# Altium schematic sheet 4th_4G - V4.1.SchDoc
size A3
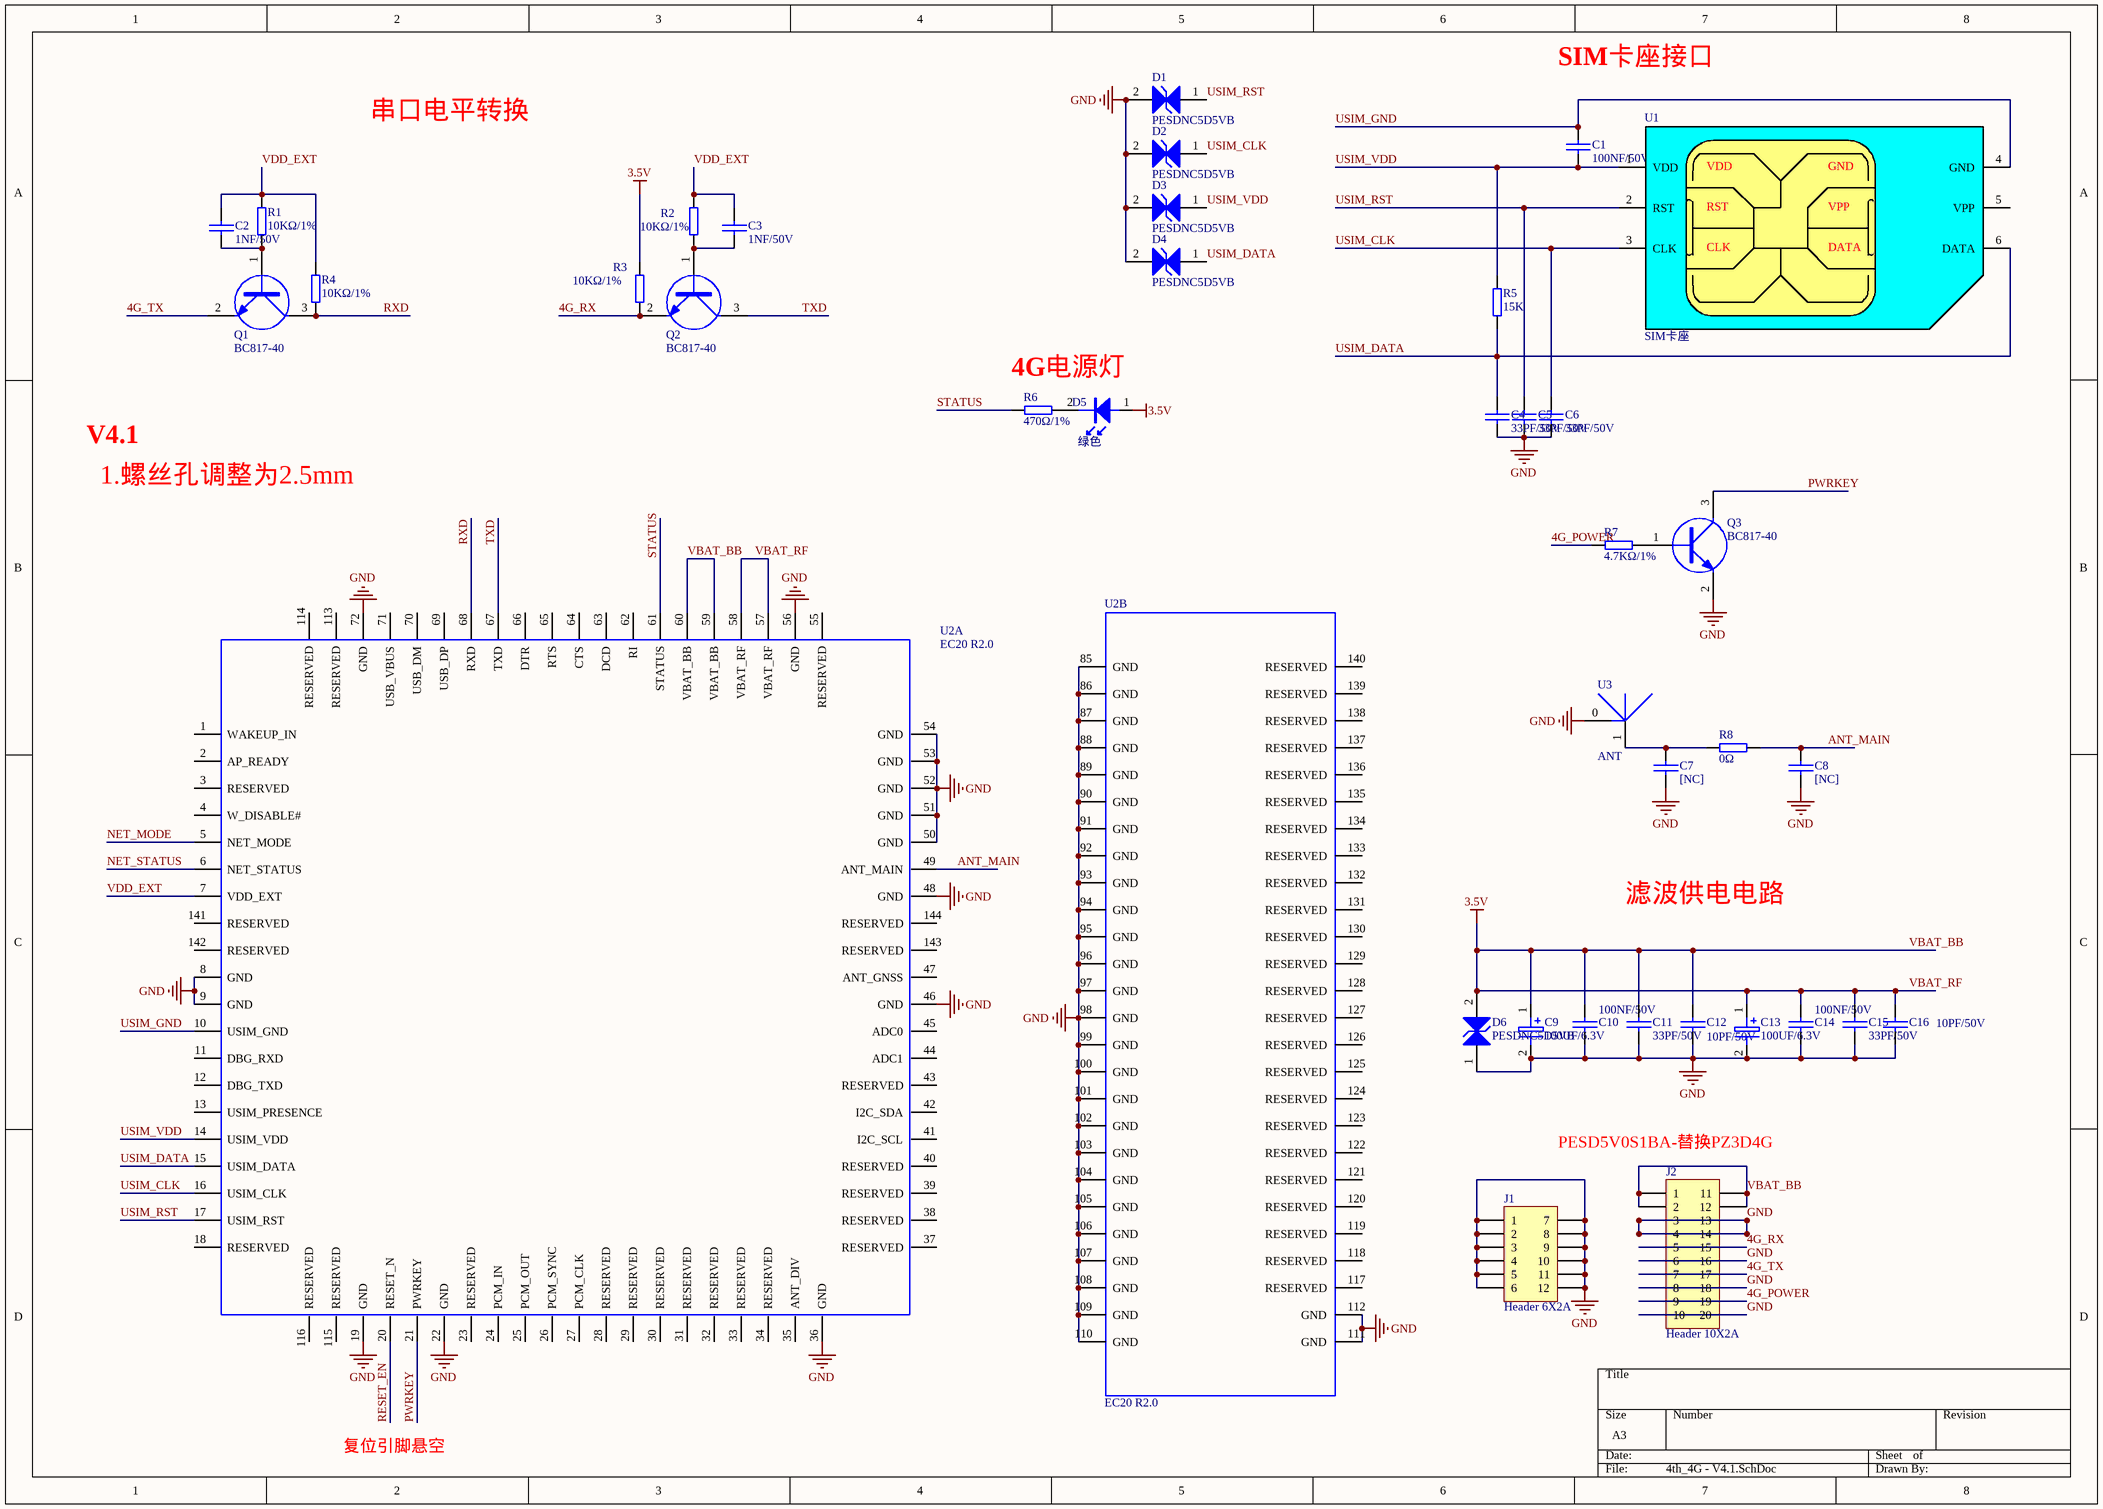
[diagram p0: 4th_4G - V4.1.SchDoc]

## Parts
C1  100NF/50V  [0603_C]
C2  1NF/50V  [0603_C]
C3  1NF/50V  [0603_C]
C4  33PF/50V  [0603_C]
C5  33PF/50V  [0603_C]
C6  33PF/50V  [0603_C]
C7  [NC]  [0603_C]
C8  [NC]  [0603_C]
C9  100UF/6.3V  [CASE-B_3528]
C10  100NF/50V  [0603_C]
C11  33PF/50V  [0603_C]
C12  10PF/50V  [0603_C]
C13  100UF/6.3V  [CASE-B_3528]
C14  100NF/50V  [0603_C]
C15  33PF/50V  [0603_C]
C16  10PF/50V  [0603_C]
D1  PESDNC5D5VB  [SOD-523]
D2  PESDNC5D5VB  [SOD-523]
D3  PESDNC5D5VB  [SOD-523]
D4  PESDNC5D5VB  [SOD-523]
D5  绿色  [0603_D]
D6  PESDNC5D5VB  [SOD-523]
J1  Header 6X2A  [HDR2X6_CEN]
J2  Header 10X2A  [HDR2X10_CEN]
Q1  BC817-40  [SOT-23-3]
Q2  BC817-40  [SOT-23-3]
Q3  BC817-40  [SOT-23-3]
R1  10KΩ/1%  [0603_R]
R2  10KΩ/1%  [0603_R]
R3  10KΩ/1%  [0603_R]
R4  10KΩ/1%  [0603_R]
R5  15K  [0603_R]
R6  470Ω/1%  [0603_R]
R7  4.7KΩ/1%  [0603_R]
R8  0Ω  [0603_R]
U1  SIM卡座  [SIM卡座-NANO掀盖式]
U2  EC20 R2.0  [EC20_R2.0]  (parts A,B of 2)
U3  ANT  [SMA-KWE/弯头]

## Nets
GND: C4.2 C5.2 C6.2 C7.2 C8.2 C9.2 C10.2 C11.2 C12.2 C13.2 C14.2 C15.2 C16.2 D1.2(K) D2.2(K) D3.2(K) D4.2(K) D6.1 J1.1 J1.2 J1.3 J1.4 J1.5 J1.6 J1.7 J1.8 J1.9 J1.10 J1.11 J1.12 J2.3 J2.4 J2.6 J2.8 J2.10 J2.13 J2.14 J2.16 J2.18 J2.20 Q3.2 U2.8(GND) U2.9(GND) U2.19(GND) U2.22(GND) U2.36(GND) U2.46(GND) U2.48(GND) U2.50(GND) U2.51(GND) U2.52(GND) U2.53(GND) U2.54(GND) U2.56(GND) U2.72(GND) U2.85(GND) U2.86(GND) U2.87(GND) U2.88(GND) U2.89(GND) U2.90(GND) U2.91(GND) U2.92(GND) U2.93(GND) U2.94(GND) U2.95(GND) U2.96(GND) U2.97(GND) U2.98(GND) U2.99(GND) U2.100(GND) U2.101(GND) U2.102(GND) U2.103(GND) U2.104(GND) U2.105(GND) U2.106(GND) U2.107(GND) U2.108(GND) U2.109(GND) U2.110(GND) U2.111(GND) U2.112(GND) U3.0
VBAT_BB: C9.1 C10.1 C11.1 C12.1 C13.1 C14.1 C15.1 C16.1 D5.1 D6.2(K) J2.1 J2.2 J2.11 J2.12 R3.2 U2.57(VBAT_RF) U2.58(VBAT_RF) U2.59(VBAT_BB) U2.60(VBAT_BB)  [also labelled 3.5V, VBAT_RF]
4G_POWER: J2.9 J2.19 R7.1
4G_RX: J2.5 J2.15 Q2.2 R3.1
4G_TX: J2.7 J2.17 Q1.2
ANT_MAIN: C8.1 R8.2 U2.49(ANT_MAIN)
NET_MODE: U2.5(NET_MODE)
NET_STATUS: U2.6(NET_STATUS)
PWRKEY: Q3.3 U2.21(PWRKEY)
RESET_EN: U2.20(RESET_N)
RXD: Q1.3 R4.1 U2.68(RXD)
STATUS: R6.1 U2.61(STATUS)
TXD: Q2.3 U2.67(TXD)
USIM_CLK: C6.1 D2.1 U1.3(CLK) U2.16(USIM_CLK)
USIM_DATA: C4.1 D4.1 R5.1 U1.6(DATA) U2.15(USIM_DATA)
USIM_GND: C1.1 U1.4(GND) U2.10(USIM_GND)
USIM_RST: C5.1 D1.1 U1.2(RST) U2.17(USIM_RST)
USIM_VDD: C1.2 D3.1 R5.2 U1.1(VDD) U2.14(USIM_VDD)
VDD_EXT: C2.1 C3.1 R1.2 R2.2 R4.2 U2.7(VDD_EXT)
NetC2_2: C2.2 Q1.1 R1.1
NetC3_2: C3.2 Q2.1 R2.1
NetC7_1: C7.1 R8.1 U3.1
NetD5_2: D5.2 R6.2
NetQ3_1: Q3.1 R7.2

Not connected (* = marked no-connect by the designer): U1 5(VPP); U2 1(WAKEUP_IN) 2(AP_READY) 3(RESERVED) 4(W_DISABLE#) 11(DBG_RXD) 12(DBG_TXD) 13(USIM_PRESENCE) 18(RESERVED) 23(RESERVED) 24(PCM_IN) 25(PCM_OUT) 26(PCM_SYNC) 27(PCM_CLK) 28(RESERVED) 29(RESERVED) 30(RESERVED) 31(RESERVED) 32(RESERVED) 33(RESERVED) 34(RESERVED) 35(ANT_DIV) 37(RESERVED) 38(RESERVED) 39(RESERVED) 40(RESERVED) 41(I2C_SCL) 42(I2C_SDA) 43(RESERVED) 44(ADC1) 45(ADC0) 47(ANT_GNSS) 55(RESERVED) 62(RI) 63(DCD) 64(CTS) 65(RTS) 66(DTR) 69(USB_DP) 70(USB_DM) 71(USB_VBUS) 113(RESERVED) 114(RESERVED) 115(RESERVED) 116(RESERVED) 117(RESERVED) 118(RESERVED) 119(RESERVED) 120(RESERVED) 121(RESERVED) 122(RESERVED) 123(RESERVED) 124(RESERVED) 125(RESERVED) 126(RESERVED) 127(RESERVED) 128(RESERVED) 129(RESERVED) 130(RESERVED) 131(RESERVED) 132(RESERVED) 133(RESERVED) 134(RESERVED) 135(RESERVED) 136(RESERVED) 137(RESERVED) 138(RESERVED) 139(RESERVED) 140(RESERVED) 141(RESERVED) 142(RESERVED) 143(RESERVED) 144(RESERVED)

## Notes on the sheet
- SIM卡座接口
- 串口电平转换
- 4G电源灯
- V4.1
- 1.螺丝孔调整为2.5mm
- 滤波供电电路
- (near J2) PESD5V0S1BA-替换PZ3D4G
- 复位引脚悬空

## Library data of the parts
C1-C8 C10-C12 C14-C16 = CAP: 无极性电容
C9 C13 = CAP POLAR: 钽电容
D1-D4 D6 = TVS: TVS 瞬态抑制二极管; Published: 8-Jun-2000; LatestRevisionDate: 17-Jul-2002; LatestRevisionNote: Re-released for DXP Platform.; PackageReference: DIODE-0.7; Publisher: Altium Limited
D5 = LED: 发光二极管
J1 = Header 6X2A: Header, 6-Pin, Dual row; LatestRevisionDate: 17-Jul-2002; LatestRevisionNote: Re-released for DXP Platform.; Publisher: Altium Limited
J2 = Header 10X2A: Header, 10-Pin, Dual row; LatestRevisionDate: 17-Jul-2002; LatestRevisionNote: Re-released for DXP Platform.; Publisher: Altium Limited
Q1 Q2 = S8050: NPN
Q3 = BC817-40: NPN三极管; Ic: 0.5A; Vceo: 45V; Vcbo: 50V; Vebo: 5V; Pc: 0.3W
R1-R8 = RES2: 电阻
U1 = SIM卡座: 无保护引脚SIM卡座
U2 = EC20 R2.0: 移远通信4G; Value: *; Part Description: *; PCB DECAL: *
U3 = ANT: 天线座